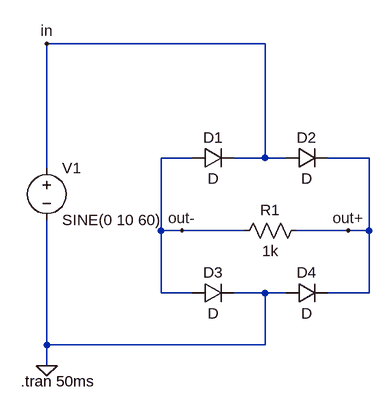
[diagram p0: schematic In-class 3-2.asc]
In-class 3-2.asc, the LTspice schematic file:
Version 4.1
SHEET 1 880 680
WIRE 384 -48 48 -48
WIRE 272 128 224 128
WIRE 384 128 384 -48
WIRE 384 128 336 128
WIRE 416 128 384 128
WIRE 544 128 480 128
WIRE 48 144 48 -48
WIRE 224 240 224 128
WIRE 256 240 224 240
WIRE 352 240 256 240
WIRE 512 240 432 240
WIRE 544 240 544 128
WIRE 544 240 512 240
WIRE 224 336 224 240
WIRE 272 336 224 336
WIRE 384 336 336 336
WIRE 416 336 384 336
WIRE 544 336 544 240
WIRE 544 336 480 336
WIRE 48 416 48 224
WIRE 384 416 384 336
WIRE 384 416 48 416
WIRE 48 448 48 416
FLAG 48 448 0
FLAG 256 240 out-
FLAG 512 240 out+
FLAG 48 -48 in
SYMBOL voltage 48 128 R0
WINDOW 123 0 0 Left 0
WINDOW 39 0 0 Left 0
SYMATTR InstName V1
SYMATTR Value SINE(0 10 60)
SYMBOL diode 272 144 R270
WINDOW 0 32 32 VTop 2
WINDOW 3 0 32 VBottom 2
SYMATTR InstName D1
SYMBOL diode 416 144 R270
WINDOW 0 32 32 VTop 2
WINDOW 3 0 32 VBottom 2
SYMATTR InstName D2
SYMBOL diode 272 352 R270
WINDOW 0 32 32 VTop 2
WINDOW 3 0 32 VBottom 2
SYMATTR InstName D3
SYMBOL diode 416 352 R270
WINDOW 0 32 32 VTop 2
WINDOW 3 0 32 VBottom 2
SYMATTR InstName D4
SYMBOL res 448 224 R90
WINDOW 0 0 56 VBottom 2
WINDOW 3 32 56 VTop 2
SYMATTR InstName R1
SYMATTR Value 1k
TEXT 8 472 Left 2 !.tran 50ms

The netlist it stands for:
* In-class 3-2.asc
V1 in 0 SINE(0 10 60)
D1 out- in D
D2 in out+ D
D3 out- 0 D
D4 0 out+ D
R1 out+ out- 1k
.model D D
.lib standard.dio
.tran 50ms
.backanno
.end